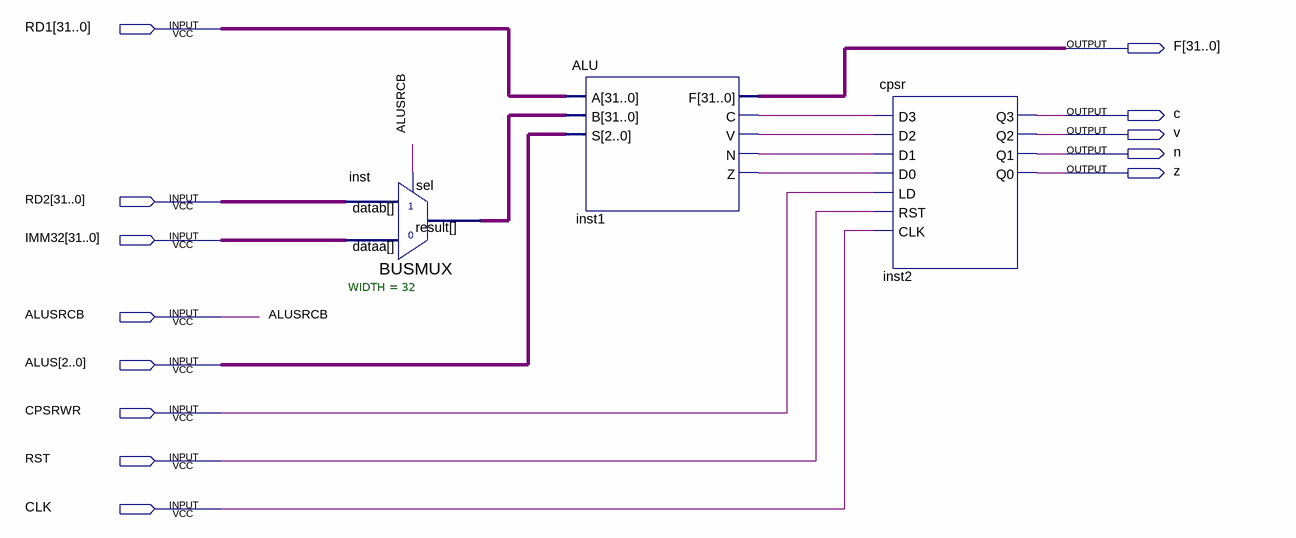
[diagram p0: schematic sheet]
// Quartus schematic execute.bdf as structural Verilog: 3 symbols, 13 pins
module execute (
  input  [31:0] RD1,
  input  [31:0] RD2,
  input  [31:0] IMM32,
  input  ALUSRCB,
  input  [2:0] ALUS,
  input  CPSRWR,
  input  RST,
  input  CLK,
  output [31:0] F,
  output c,
  output v,
  output n,
  output z
);

  wire inst1_c, inst1_n, inst1_v, inst1_z;
  wire [31:0] inst_result;

  BUSMUX #(.WIDTH(32)) inst (.datab(RD2), .sel(ALUSRCB), .dataa(IMM32), .result(inst_result));
  ALU inst1 (.A(RD1), .B(inst_result), .S(ALUS), .F(F), .C(inst1_c), .V(inst1_v), .N(inst1_n), .Z(inst1_z));
  cpsr inst2 (
    .D3(inst1_c), .D2(inst1_v), .D1(inst1_n), .D0(inst1_z), .LD(CPSRWR), .RST(RST), .CLK(CLK), .Q3(c),
    .Q2(v), .Q1(n), .Q0(z));
endmodule
